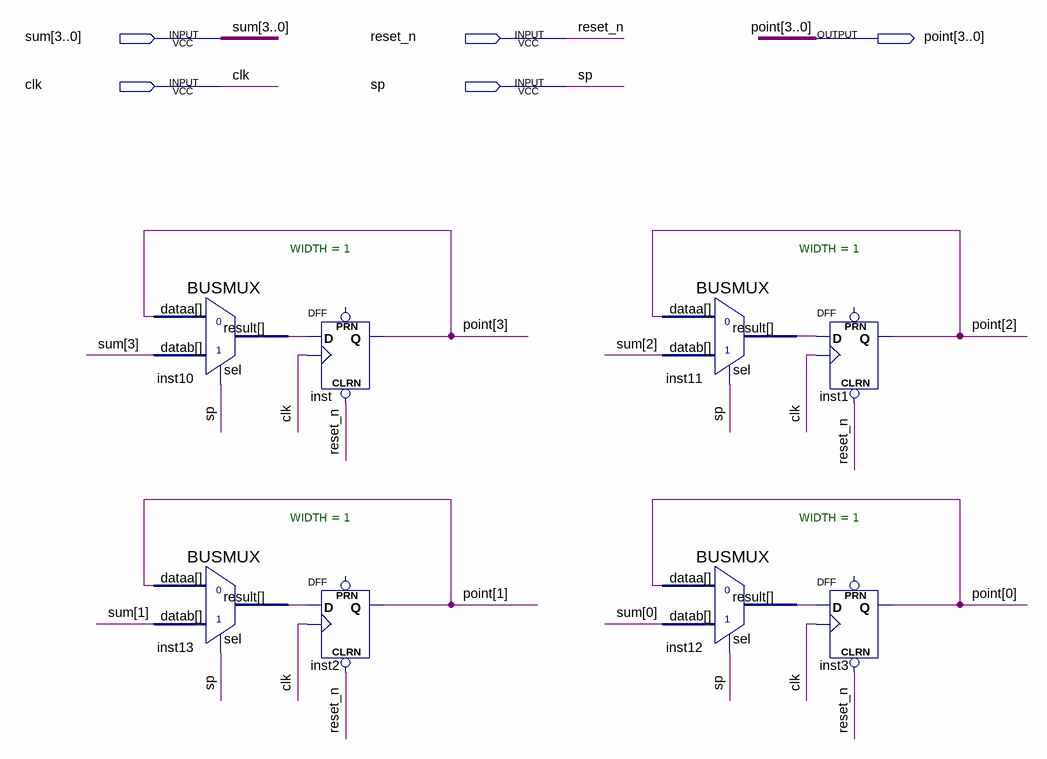
[diagram p0: schematic sheet]
// Quartus schematic register.bdf as structural Verilog: 8 symbols, 5 pins
module register (
  input  [3:0] sum,
  input  reset_n,
  input  clk,
  input  sp,
  output [3:0] point
);

  wire inst10_result, inst11_result, inst12_result, inst13_result;

  BUSMUX #(.WIDTH(1)) inst10 (.datab(sum[3]), .sel(sp), .dataa(point[3]), .result(inst10_result));
  BUSMUX #(.WIDTH(1)) inst13 (.datab(sum[1]), .sel(sp), .dataa(point[1]), .result(inst13_result));
  DFF inst (.CLRN(reset_n), .CLK(clk), .D(inst10_result), .Q(point[3]));  // open: PRN
  DFF inst2 (.CLRN(reset_n), .CLK(clk), .D(inst13_result), .Q(point[1]));  // open: PRN
  BUSMUX #(.WIDTH(1)) inst11 (.datab(sum[2]), .sel(sp), .dataa(point[2]), .result(inst11_result));
  BUSMUX #(.WIDTH(1)) inst12 (.datab(sum[0]), .sel(sp), .dataa(point[0]), .result(inst12_result));
  DFF inst1 (.CLRN(reset_n), .CLK(clk), .D(inst11_result), .Q(point[2]));  // open: PRN
  DFF inst3 (.CLRN(reset_n), .CLK(clk), .D(inst12_result), .Q(point[0]));  // open: PRN
endmodule
